# EAGLE schematic Circuit (EAGLE 9.6.2)
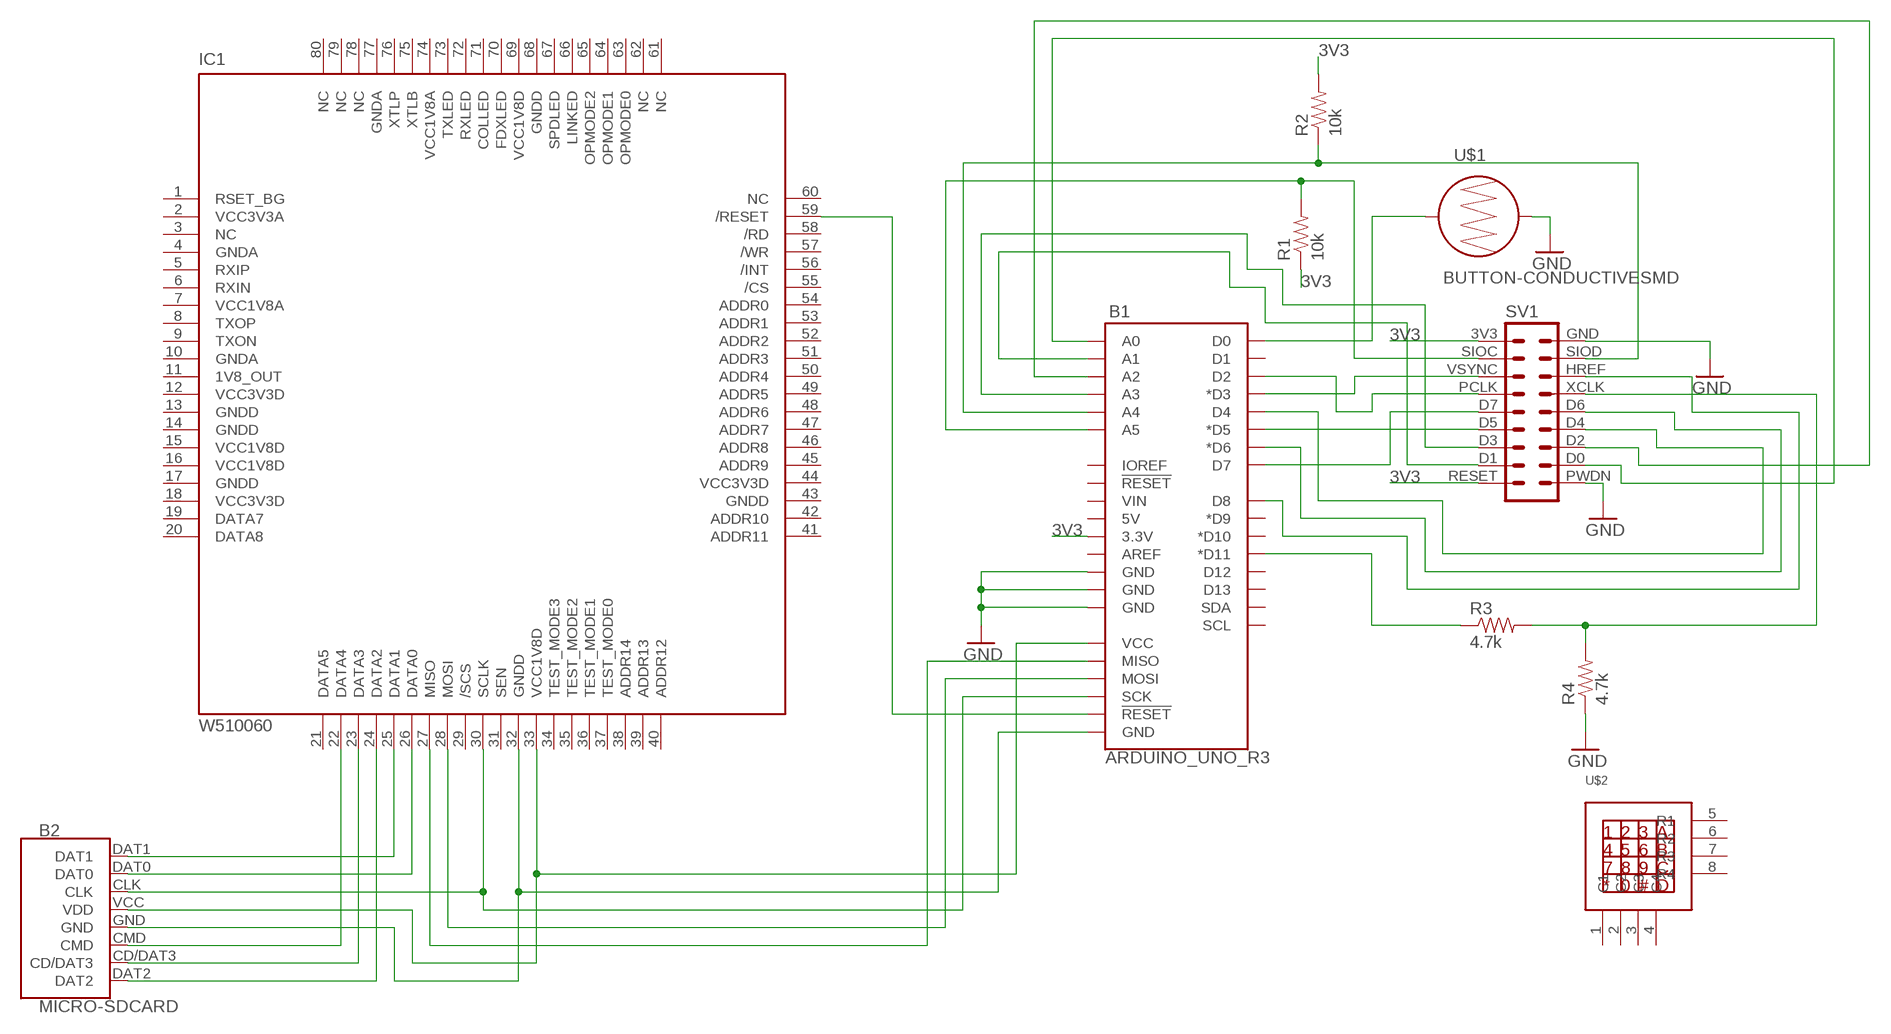
[diagram p0: schematic, sheet 1]

## Parts
B1  ARDUINO_UNO_R3  [ARDUINO_R3]
B2  MICRO-SDCARD  [MICRO-SDCARD]
IC1  W510060  [W5100]
R1  10k  RESISTOR0402  [0402-RES]
R2  10k  RESISTOR0402  [0402-RES]
R3  4.7k  RESISTOR0402  [0402-RES]
R4  4.7k  RESISTOR0402  [0402-RES]
SV1  ML16L  [ML16L]
U$1  BUTTON-CONDUCTIVESMD  [BUTTON-CONDUCTIVE]
U$2  KEYPAD4X4  [KEYPAD4X4]

## Nets
3V3: B1.3.3V R1.1 R2.2 SV1.3V3 SV1.RESET
GND: B1.GND@2(GND) B1.GND@3(GND) B1.GND@4(GND) R4.1 SV1.GND SV1.PWDN U$1.2
N$1: B1.A4 R2.1 SV1.SIOD
N$2: B1.D3(*D3) SV1.VSYNC
N$3: B1.A5 R1.2 SV1.SIOC
N$4: B1.D8 SV1.HREF
N$5: B1.D2 SV1.PCLK
N$6: R3.2 R4.2 SV1.XCLK
N$7: B1.D11(*D11) R3.1
N$8: B1.D7 SV1.D7
N$9: B1.D5(*D5) SV1.D5
N$10: B1.D6(*D6) SV1.D6
N$11: B1.D4 SV1.D4
N$12: B1.A2 SV1.D2
N$13: B1.A0 SV1.D0
N$14: B1.A3 SV1.D3
N$15: B1.A1 SV1.D1
N$16: B1.MISO IC1.27(MISO)
N$17: B1.MOSI IC1.28(MOSI)
N$18: B1.SCK B2.CLK IC1.30(SCLK)
N$19: B1.GND@1(GND) B2.GND IC1.32(GNDD)
N$20: B1.VCC B2.VCC(VDD) IC1.33(VCC1V8D)
N$21: B1.RESET@2(!RESET!) IC1.59(/RESET)
N$22: B2.DAT1 IC1.25(DATA1)
N$23: B2.DAT0 IC1.26(DATA0)
N$25: B1.D0 U$1.1
N$26: B2.CMD IC1.22(DATA4)
N$27: B2.CD/DAT3 IC1.23(DATA3)
N$28: B2.DAT2 IC1.24(DATA2)
Unconnected: B1.5V B1.AREF B1.D1 B1.D9(*D9) B1.D10(*D10) B1.D12 B1.D13 B1.IOREF B1.RESET@1(!RESET!) B1.SCL B1.SDA B1.VIN IC1.1(RSET_BG) IC1.2(VCC3V3A) IC1.3(NC) IC1.4(GNDA) IC1.5(RXIP) IC1.6(RXIN) IC1.7(VCC1V8A) IC1.8(TXOP) IC1.9(TXON) IC1.10(GNDA) IC1.12(VCC3V3D) IC1.13(GNDD) IC1.14(GNDD) IC1.15(VCC1V8D) IC1.16(VCC1V8D) IC1.17(GNDD) IC1.18(VCC3V3D) IC1.19(DATA7) IC1.20(DATA8) IC1.21(DATA5) IC1.29(/SCS) IC1.34(TEST_MODE3) IC1.35(TEST_MODE2) IC1.36(TEST_MODE1) IC1.37(TEST_MODE0) IC1.38(ADDR14) IC1.39(ADDR13) IC1.40(ADDR12) IC1.41(ADDR11) IC1.42(ADDR10) IC1.43(GNDD) IC1.44(VCC3V3D) IC1.45(ADDR9) IC1.46(ADDR8) IC1.47(ADDR7) IC1.49(ADDR5) IC1.50(ADDR4) IC1.52(ADDR2) IC1.53(ADDR1) IC1.54(ADDR0) IC1.55(/CS) IC1.56(/INT) IC1.57(/WR) IC1.58(/RD) IC1.60(NC) IC1.61(NC) IC1.62(NC) IC1.63(OPMODE0) IC1.64(OPMODE1) IC1.65(OPMODE2) IC1.66(LINKED) IC1.67(SPDLED) IC1.68(GNDD) IC1.69(VCC1V8D) IC1.72(RXLED) IC1.73(TXLED) IC1.74(VCC1V8A) IC1.75(XTLB) IC1.76(XTLP) IC1.77(GNDA) IC1.78(NC) IC1.79(NC) IC1.80(NC) U$2.1(C1) U$2.2(C2) U$2.3(C3) U$2.4(C4) U$2.5(R1) U$2.6(R2) U$2.7(R3) U$2.8(R4)

## Power pins joined to a net without a drawn wire
1V8_OUT: IC1.11(1V8_OUT)
ADDR3: IC1.51(ADDR3)
ADDR6: IC1.48(ADDR6)
COLLED: IC1.71(COLLED)
FDXLED: IC1.70(FDXLED)
SEN: IC1.31(SEN)

## Library data of the parts
B1 = SparkFun-Boards:ARDUINO_UNO_R3: Arduino R3 Footprint with SPI header Arduino Uno R3 Compatible Footprint. Matches PCB size of the original board. SparkFun Products: SAMD21 Dev Breakout <https://www.sparkfun.com/products/13672> RedBoard <https://www.sparkfun.com/products/12757> R3 Stackable Headers <https://www.sparkfun.com/products/11417>
B2 = SparkFun-Boards:MICRO-SDCARD: microSD Card Footprint This is the mechnical footprint with connections for soldering a microSD card - NOT for a socket for the card. SparkFun Products: MicroSD Card with Adapter - 8 GB <https://www.sparkfun.com/products/11609> SparkFun microSD Sniffer <https://www.sparkfun.com/products/9419>
IC1 = ethernet:W5100: PIC18F97J60 Family 64/80/100-Pin High-Performance, 1-Mbit Flash Microcontrollers with Ethernet Source: http://ww1.microchip.com/downloads/en/DeviceDoc/39762d.pdf; MPN: PIC18F86J60-I/PT; OC_FARNELL: unknown; OC_NEWARK: 56K7306
R1-R4 = SparkFun-Resistors:RESISTOR: Resistor Basic schematic elements and footprints for 0603, 1206, and PTH resistors.
SV1 = ov7670:ML16L: HARTING; OC_FARNELL: unknown; OC_NEWARK: unknown
U$1 = SparkFun-Electromechanical:BUTTON-CONDUCTIVE: Used with rubber key pads. This one was designed and proven to work with the PolyCase Key FOB enclosures.
U$2 = keypad_4x4_raw:KEYPAD4X4